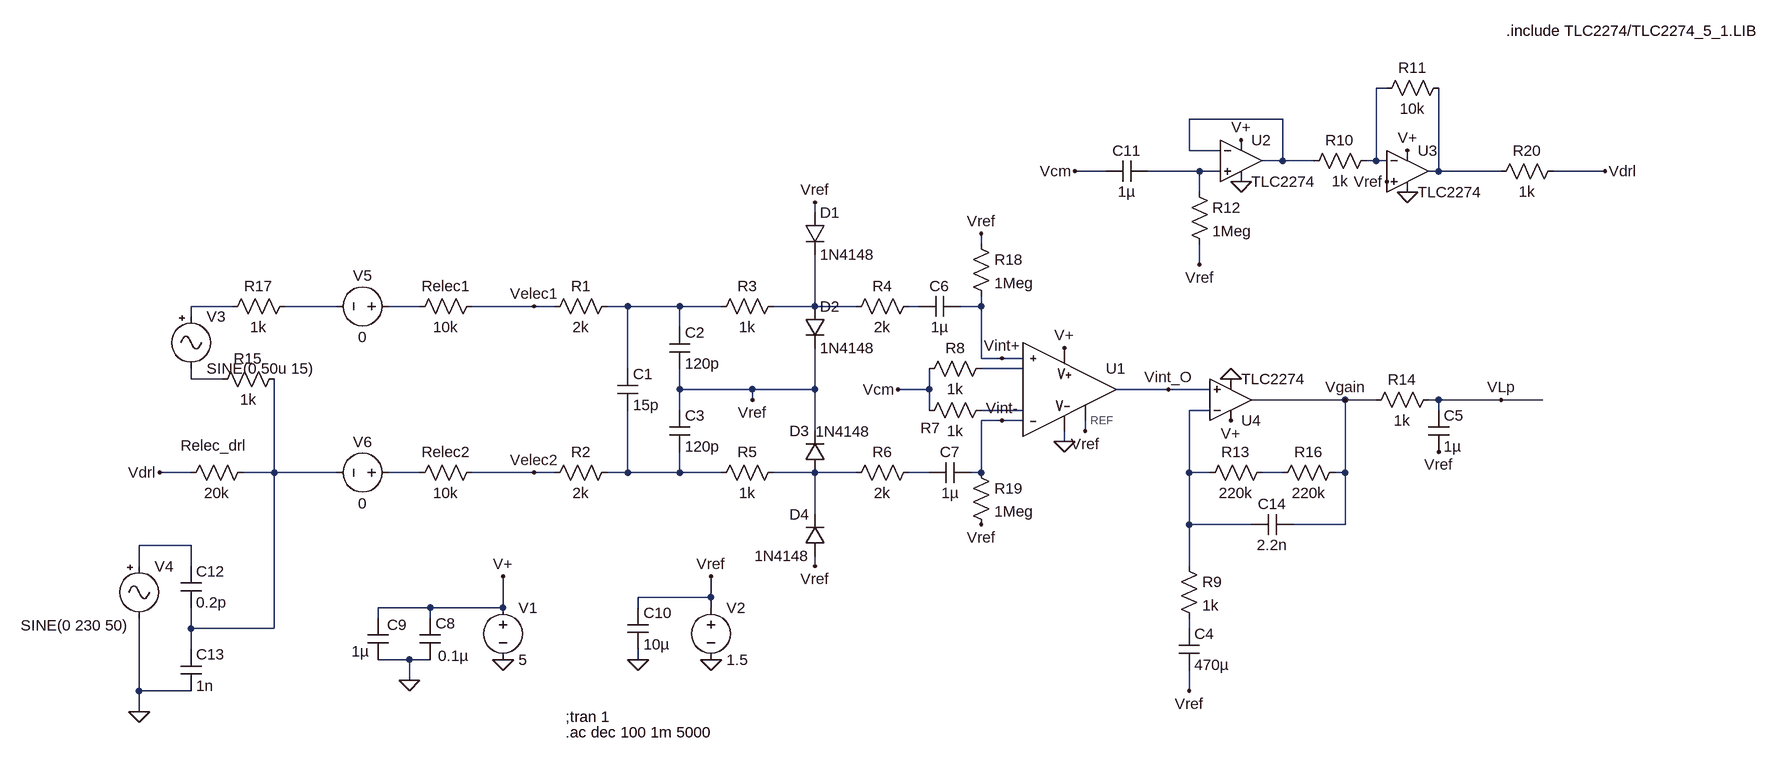
[diagram p0: schematic EEG_tlc2274.asc]
EEG_tlc2274.asc, the LTspice schematic file:
Version 4
SHEET 1 1884 824
WIRE 1296 -288 1280 -288
WIRE 1136 -240 992 -240
WIRE 992 -192 992 -240
WIRE 1040 -192 992 -192
WIRE 1136 -176 1136 -240
WIRE 1136 -176 1104 -176
WIRE 1184 -176 1136 -176
WIRE 1280 -176 1280 -288
WIRE 1280 -176 1264 -176
WIRE 1296 -176 1280 -176
WIRE 864 -160 816 -160
WIRE 1008 -160 928 -160
WIRE 1040 -160 1008 -160
WIRE 1376 -160 1376 -288
WIRE 1376 -160 1360 -160
WIRE 1472 -160 1376 -160
WIRE 1632 -160 1552 -160
WIRE 1008 -128 1008 -160
WIRE 416 -96 416 -112
WIRE 672 -48 672 -64
WIRE 1008 -16 1008 -48
WIRE -480 48 -544 48
WIRE -320 48 -400 48
WIRE -192 48 -240 48
WIRE -16 48 -112 48
WIRE 16 48 -16 48
WIRE 128 48 96 48
WIRE 208 48 128 48
WIRE 272 48 208 48
WIRE 416 48 416 -32
WIRE 416 48 352 48
WIRE 480 48 416 48
WIRE 576 48 560 48
WIRE 672 48 672 32
WIRE 672 48 640 48
WIRE -544 64 -544 48
WIRE 208 80 208 48
WIRE 672 128 672 48
WIRE 704 128 672 128
WIRE 736 128 704 128
WIRE 128 144 128 48
WIRE 736 144 672 144
WIRE -544 160 -544 144
WIRE -496 160 -544 160
WIRE 208 176 208 144
WIRE 320 176 208 176
WIRE 416 176 416 112
WIRE 416 176 320 176
WIRE 592 176 592 144
WIRE 592 176 544 176
WIRE 960 176 880 176
WIRE 1024 176 960 176
WIRE 320 192 320 176
WIRE 1232 192 1088 192
WIRE 1280 192 1232 192
WIRE 1376 192 1360 192
WIRE 1472 192 1376 192
WIRE 1536 192 1472 192
WIRE 208 208 208 176
WIRE 592 208 592 176
WIRE 736 208 672 208
WIRE 1024 208 992 208
WIRE 1376 208 1376 192
WIRE 704 224 672 224
WIRE 736 224 704 224
WIRE 416 240 416 176
WIRE 832 240 832 224
WIRE 800 256 800 240
WIRE -544 304 -592 304
WIRE -416 304 -416 160
WIRE -416 304 -464 304
WIRE -320 304 -416 304
WIRE -192 304 -240 304
WIRE -16 304 -112 304
WIRE 16 304 -16 304
WIRE 128 304 128 208
WIRE 128 304 96 304
WIRE 208 304 208 272
WIRE 208 304 128 304
WIRE 272 304 208 304
WIRE 416 304 352 304
WIRE 480 304 416 304
WIRE 592 304 560 304
WIRE 672 304 672 224
WIRE 672 304 656 304
WIRE 992 304 992 208
WIRE 1024 304 992 304
WIRE 1136 304 1104 304
WIRE 1232 304 1232 192
WIRE 1232 304 1216 304
WIRE 416 368 416 304
WIRE 992 384 992 304
WIRE 1088 384 992 384
WIRE 1232 384 1232 304
WIRE 1232 384 1152 384
WIRE -544 416 -624 416
WIRE -624 448 -624 416
WIRE -544 448 -544 416
WIRE 416 448 416 432
WIRE 992 448 992 384
WIRE 256 496 256 464
WIRE 256 496 144 496
WIRE -176 512 -256 512
WIRE -64 512 -64 464
WIRE -64 512 -176 512
WIRE 144 512 144 496
WIRE 256 512 256 496
WIRE -256 528 -256 512
WIRE -176 528 -176 512
WIRE -544 544 -544 512
WIRE -416 544 -416 304
WIRE -416 544 -544 544
WIRE 992 544 992 528
WIRE -544 576 -544 544
WIRE -208 592 -256 592
WIRE -176 592 -208 592
WIRE 144 592 144 576
WIRE -208 624 -208 592
WIRE -624 640 -624 528
WIRE -544 640 -624 640
WIRE 992 640 992 608
WIRE -624 672 -624 640
FLAG 256 592 0
FLAG -64 592 0
FLAG -64 464 V+
FLAG 256 464 Vref
FLAG 416 -112 Vref
FLAG 416 448 Vref
FLAG 320 192 Vref
FLAG -16 48 Velec1
FLAG -16 304 Velec2
FLAG 832 240 Vref
FLAG 800 112 V+
FLAG 800 256 0
FLAG 960 176 Vint_O
FLAG 1072 -208 V+
FLAG 1072 -144 0
FLAG 1328 -128 0
FLAG 1328 -192 V+
FLAG 1008 -16 Vref
FLAG 1056 160 0
FLAG 1056 224 V+
FLAG 1232 192 Vgain
FLAG 1472 192 VLp
FLAG 1296 -144 Vref
FLAG 1632 -160 Vdrl
FLAG 672 384 Vref
FLAG 672 -64 Vref
FLAG -208 624 0
FLAG 144 592 0
FLAG 704 128 Vint+
FLAG 704 224 Vint-
FLAG -624 672 0
FLAG 992 640 Vref
FLAG 1376 272 Vref
FLAG 544 176 Vcm
FLAG 816 -160 Vcm
FLAG -592 304 Vdrl
SYMBOL res 112 32 R90
WINDOW 0 0 56 VBottom 2
WINDOW 3 32 56 VTop 2
SYMATTR InstName R1
SYMATTR Value 2k
SYMBOL res 112 288 R90
WINDOW 0 0 56 VBottom 2
WINDOW 3 32 56 VTop 2
SYMATTR InstName R2
SYMATTR Value 2k
SYMBOL cap 112 144 R0
SYMATTR InstName C1
SYMATTR Value 15p
SYMBOL cap 192 80 R0
SYMATTR InstName C2
SYMATTR Value 120p
SYMBOL cap 192 208 R0
SYMATTR InstName C3
SYMATTR Value 120p
SYMBOL res 368 32 R90
WINDOW 0 0 56 VBottom 2
WINDOW 3 32 56 VTop 2
SYMATTR InstName R3
SYMATTR Value 1k
SYMBOL res 576 32 R90
WINDOW 0 0 56 VBottom 2
WINDOW 3 32 56 VTop 2
SYMATTR InstName R4
SYMATTR Value 2k
SYMBOL res 368 288 R90
WINDOW 0 0 56 VBottom 2
WINDOW 3 32 56 VTop 2
SYMATTR InstName R5
SYMATTR Value 1k
SYMBOL res 576 288 R90
WINDOW 0 0 56 VBottom 2
WINDOW 3 32 56 VTop 2
SYMATTR InstName R6
SYMATTR Value 2k
SYMBOL diode 400 -96 R0
SYMATTR InstName D1
SYMATTR Value 1N4148
SYMBOL voltage -64 496 R0
WINDOW 123 0 0 Left 2
WINDOW 39 0 0 Left 2
SYMATTR InstName V1
SYMATTR Value 5
SYMBOL voltage 256 496 R0
WINDOW 123 0 0 Left 2
WINDOW 39 0 0 Left 2
SYMATTR InstName V2
SYMATTR Value 1.5
SYMBOL IMmodl\\AD623 848 176 R0
SYMATTR InstName U1
SYMBOL res 688 192 R90
WINDOW 0 59 94 VBottom 2
WINDOW 3 32 56 VTop 2
SYMATTR InstName R7
SYMATTR Value 1k
SYMBOL res 688 128 R90
WINDOW 0 0 56 VBottom 2
WINDOW 3 32 56 VTop 2
SYMATTR InstName R8
SYMATTR Value 1k
SYMBOL res 1280 -192 R90
WINDOW 0 0 56 VBottom 2
WINDOW 3 32 56 VTop 2
SYMATTR InstName R10
SYMATTR Value 1k
SYMBOL res 1392 -304 R90
WINDOW 0 0 56 VBottom 2
WINDOW 3 32 56 VTop 2
SYMATTR InstName R11
SYMATTR Value 10k
SYMBOL res 992 -144 R0
SYMATTR InstName R12
SYMATTR Value 1Meg
SYMBOL res 976 432 R0
SYMATTR InstName R9
SYMATTR Value 1k
SYMBOL res 1120 288 R90
WINDOW 0 0 56 VBottom 2
WINDOW 3 32 56 VTop 2
SYMATTR InstName R13
SYMATTR Value 220k
SYMBOL cap 976 544 R0
SYMATTR InstName C4
SYMATTR Value 470µ
SYMBOL res 1376 176 R90
WINDOW 0 0 56 VBottom 2
WINDOW 3 32 56 VTop 2
SYMATTR InstName R14
SYMATTR Value 1k
SYMBOL cap 1360 208 R0
SYMATTR InstName C5
SYMATTR Value 1µ
SYMBOL res -96 32 R90
WINDOW 0 0 56 VBottom 2
WINDOW 3 32 56 VTop 2
SYMATTR InstName Relec1
SYMATTR Value 10k
SYMBOL res -96 288 R90
WINDOW 0 0 56 VBottom 2
WINDOW 3 32 56 VTop 2
SYMATTR InstName Relec2
SYMATTR Value 10k
SYMBOL cap 640 32 R90
WINDOW 0 0 32 VBottom 2
WINDOW 3 32 32 VTop 2
SYMATTR InstName C6
SYMATTR Value 1µ
SYMBOL cap 656 288 R90
WINDOW 0 0 32 VBottom 2
WINDOW 3 32 32 VTop 2
SYMATTR InstName C7
SYMATTR Value 1µ
SYMBOL res 656 -64 R0
SYMATTR InstName R18
SYMATTR Value 1Meg
SYMBOL res 656 288 R0
SYMATTR InstName R19
SYMATTR Value 1Meg
SYMBOL diode 400 48 R0
SYMATTR InstName D2
SYMATTR Value 1N4148
SYMBOL diode 432 304 R180
WINDOW 0 24 64 Left 2
WINDOW 3 -70 63 Left 2
SYMATTR InstName D3
SYMATTR Value 1N4148
SYMBOL diode 432 432 R180
WINDOW 0 24 64 Left 2
WINDOW 3 24 0 Left 2
SYMATTR InstName D4
SYMATTR Value 1N4148
SYMBOL cap -192 528 R0
WINDOW 3 28 58 Left 2
SYMATTR Value 0.1µ
SYMATTR InstName C8
SYMBOL cap -272 528 R0
WINDOW 0 30 10 Left 2
WINDOW 3 -25 51 Left 2
SYMATTR InstName C9
SYMATTR Value 1µ
SYMBOL cap 128 512 R0
SYMATTR InstName C10
SYMATTR Value 10µ
SYMBOL cap 928 -176 R90
WINDOW 0 0 32 VBottom 2
WINDOW 3 32 32 VTop 2
SYMATTR InstName C11
SYMATTR Value 1µ
SYMBOL res -400 144 R90
WINDOW 0 0 56 VBottom 2
WINDOW 3 32 56 VTop 2
SYMATTR InstName R15
SYMATTR Value 1k
SYMBOL res -448 288 R90
WINDOW 0 -10 61 VBottom 2
WINDOW 3 32 56 VTop 2
SYMATTR InstName Relec_drl
SYMATTR Value 20k
SYMBOL Misc\\signal -624 432 R0
WINDOW 3 -182 107 Left 2
WINDOW 123 0 0 Left 2
WINDOW 39 0 0 Left 2
SYMATTR Value SINE(0 230 50)
SYMATTR InstName V4
SYMBOL cap -560 448 R0
SYMATTR InstName C12
SYMATTR Value 0.2p
SYMBOL cap -560 576 R0
SYMATTR InstName C13
SYMATTR Value 1n
SYMBOL res 1232 288 R90
WINDOW 0 0 56 VBottom 2
WINDOW 3 32 56 VTop 2
SYMATTR InstName R16
SYMATTR Value 220k
SYMBOL cap 1152 368 R90
WINDOW 0 0 32 VBottom 2
WINDOW 3 32 32 VTop 2
SYMATTR InstName C14
SYMATTR Value 2.2n
SYMBOL res -384 32 R90
WINDOW 0 0 56 VBottom 2
WINDOW 3 32 56 VTop 2
SYMATTR InstName R17
SYMATTR Value 1k
SYMBOL voltage -224 48 R90
WINDOW 0 -32 56 VBottom 2
WINDOW 3 32 56 VTop 2
WINDOW 123 0 0 Left 2
WINDOW 39 0 0 Left 2
SYMATTR InstName V5
SYMATTR Value 0
SYMBOL voltage -224 304 R90
WINDOW 0 -32 56 VBottom 2
WINDOW 3 32 56 VTop 2
WINDOW 123 0 0 Left 2
WINDOW 39 0 0 Left 2
SYMATTR InstName V6
SYMATTR Value 0
SYMBOL res 1568 -176 R90
WINDOW 0 0 56 VBottom 2
WINDOW 3 32 56 VTop 2
SYMATTR InstName R20
SYMATTR Value 1k
SYMBOL Opamps\\opamp2 1328 -224 R0
SYMATTR InstName U3
SYMATTR Value TLC2274
SYMBOL Opamps\\opamp2 1072 -240 R0
SYMATTR InstName U2
SYMATTR Value TLC2274
SYMBOL Opamps\\opamp2 1056 256 M180
SYMATTR InstName U4
SYMATTR Value TLC2274
SYMBOL Misc\\signal -544 48 R0
WINDOW 123 0 0 Left 2
WINDOW 39 0 0 Left 2
SYMATTR InstName V3
SYMATTR Value SINE(0 50u 15)
TEXT 32 680 Left 2 !;tran 1
TEXT 32 704 Left 2 !.ac dec 100 1m 5000
TEXT 1480 -376 Left 2 !.include TLC2274/TLC2274_5_1.LIB

The netlist it stands for:
* EEG_tlc2274.asc
R1 N008 Velec1 2k
R2 N017 Velec2 2k
C1 N008 N017 15p
C2 N008 Vref 120p
C3 Vref N017 120p
R3 N009 N008 1k
R4 N010 N009 2k
R5 N018 N017 1k
R6 N019 N018 2k
D1 Vref N009 1N4148
V1 V+ 0 5
V2 Vref 0 1.5
XU1 Vint+ Vint- N011 N013 V+ 0 Vint_O Vref AD623  ; pins In+ In- RG+ RG- V+ V- OUT REF
R7 N013 Vcm 1k
R8 N011 Vcm 1k
R10 N001 N002 1k
R11 N004 N001 10k
R12 N003 Vref 1Meg
R9 N014 N022 1k
R13 N020 N014 220k
C4 N022 Vref 470µ
R14 VLp Vgain 1k
C5 VLp Vref 1µ
Relec1 Velec1 N007 10k
Relec2 Velec2 N016 10k
C6 Vint+ N010 1µ
C7 Vint- N019 1µ
R18 Vref Vint+ 1Meg
R19 Vint- Vref 1Meg
D2 N009 Vref 1N4148
D3 N018 Vref 1N4148
D4 Vref N018 1N4148
C8 V+ 0 0.1µ
C9 V+ 0 1µ
C10 Vref 0 10µ
C11 N003 Vcm 1µ
R15 N015 N012 1k
Relec_drl N015 Vdrl 20k
V4 N021 0 SINE(0 230 50)
C12 N021 N015 0.2p
C13 N015 0 1n
R16 Vgain N020 220k
C14 Vgain N014 2.2n
R17 N006 N005 1k
V5 N007 N006 0
V6 N016 N015 0
R20 Vdrl N004 1k
XU3 Vref N001 V+ 0 N004 TLC2274  ; pins In+ In- V+ V- OUT
XU2 N003 N002 V+ 0 N002 TLC2274  ; pins In+ In- V+ V- OUT
XU4 Vint_O N014 V+ 0 Vgain TLC2274  ; pins In+ In- V+ V- OUT
V3 N005 N012 SINE(0 50u 15)
.model D D
.lib standard.dio
;tran 1
.ac dec 100 1m 5000
.include TLC2274/TLC2274_5_1.LIB
.lib ad623.lib
.backanno
.end